# EasyEDA schematic SCH_TRSID_2026-05-15.json
TITLE: Sheet_1; REV: 1.0; Date: 2026-05-11; Sheet: 1/1; Drawn By: chengyanyang0510; Company: Your Company
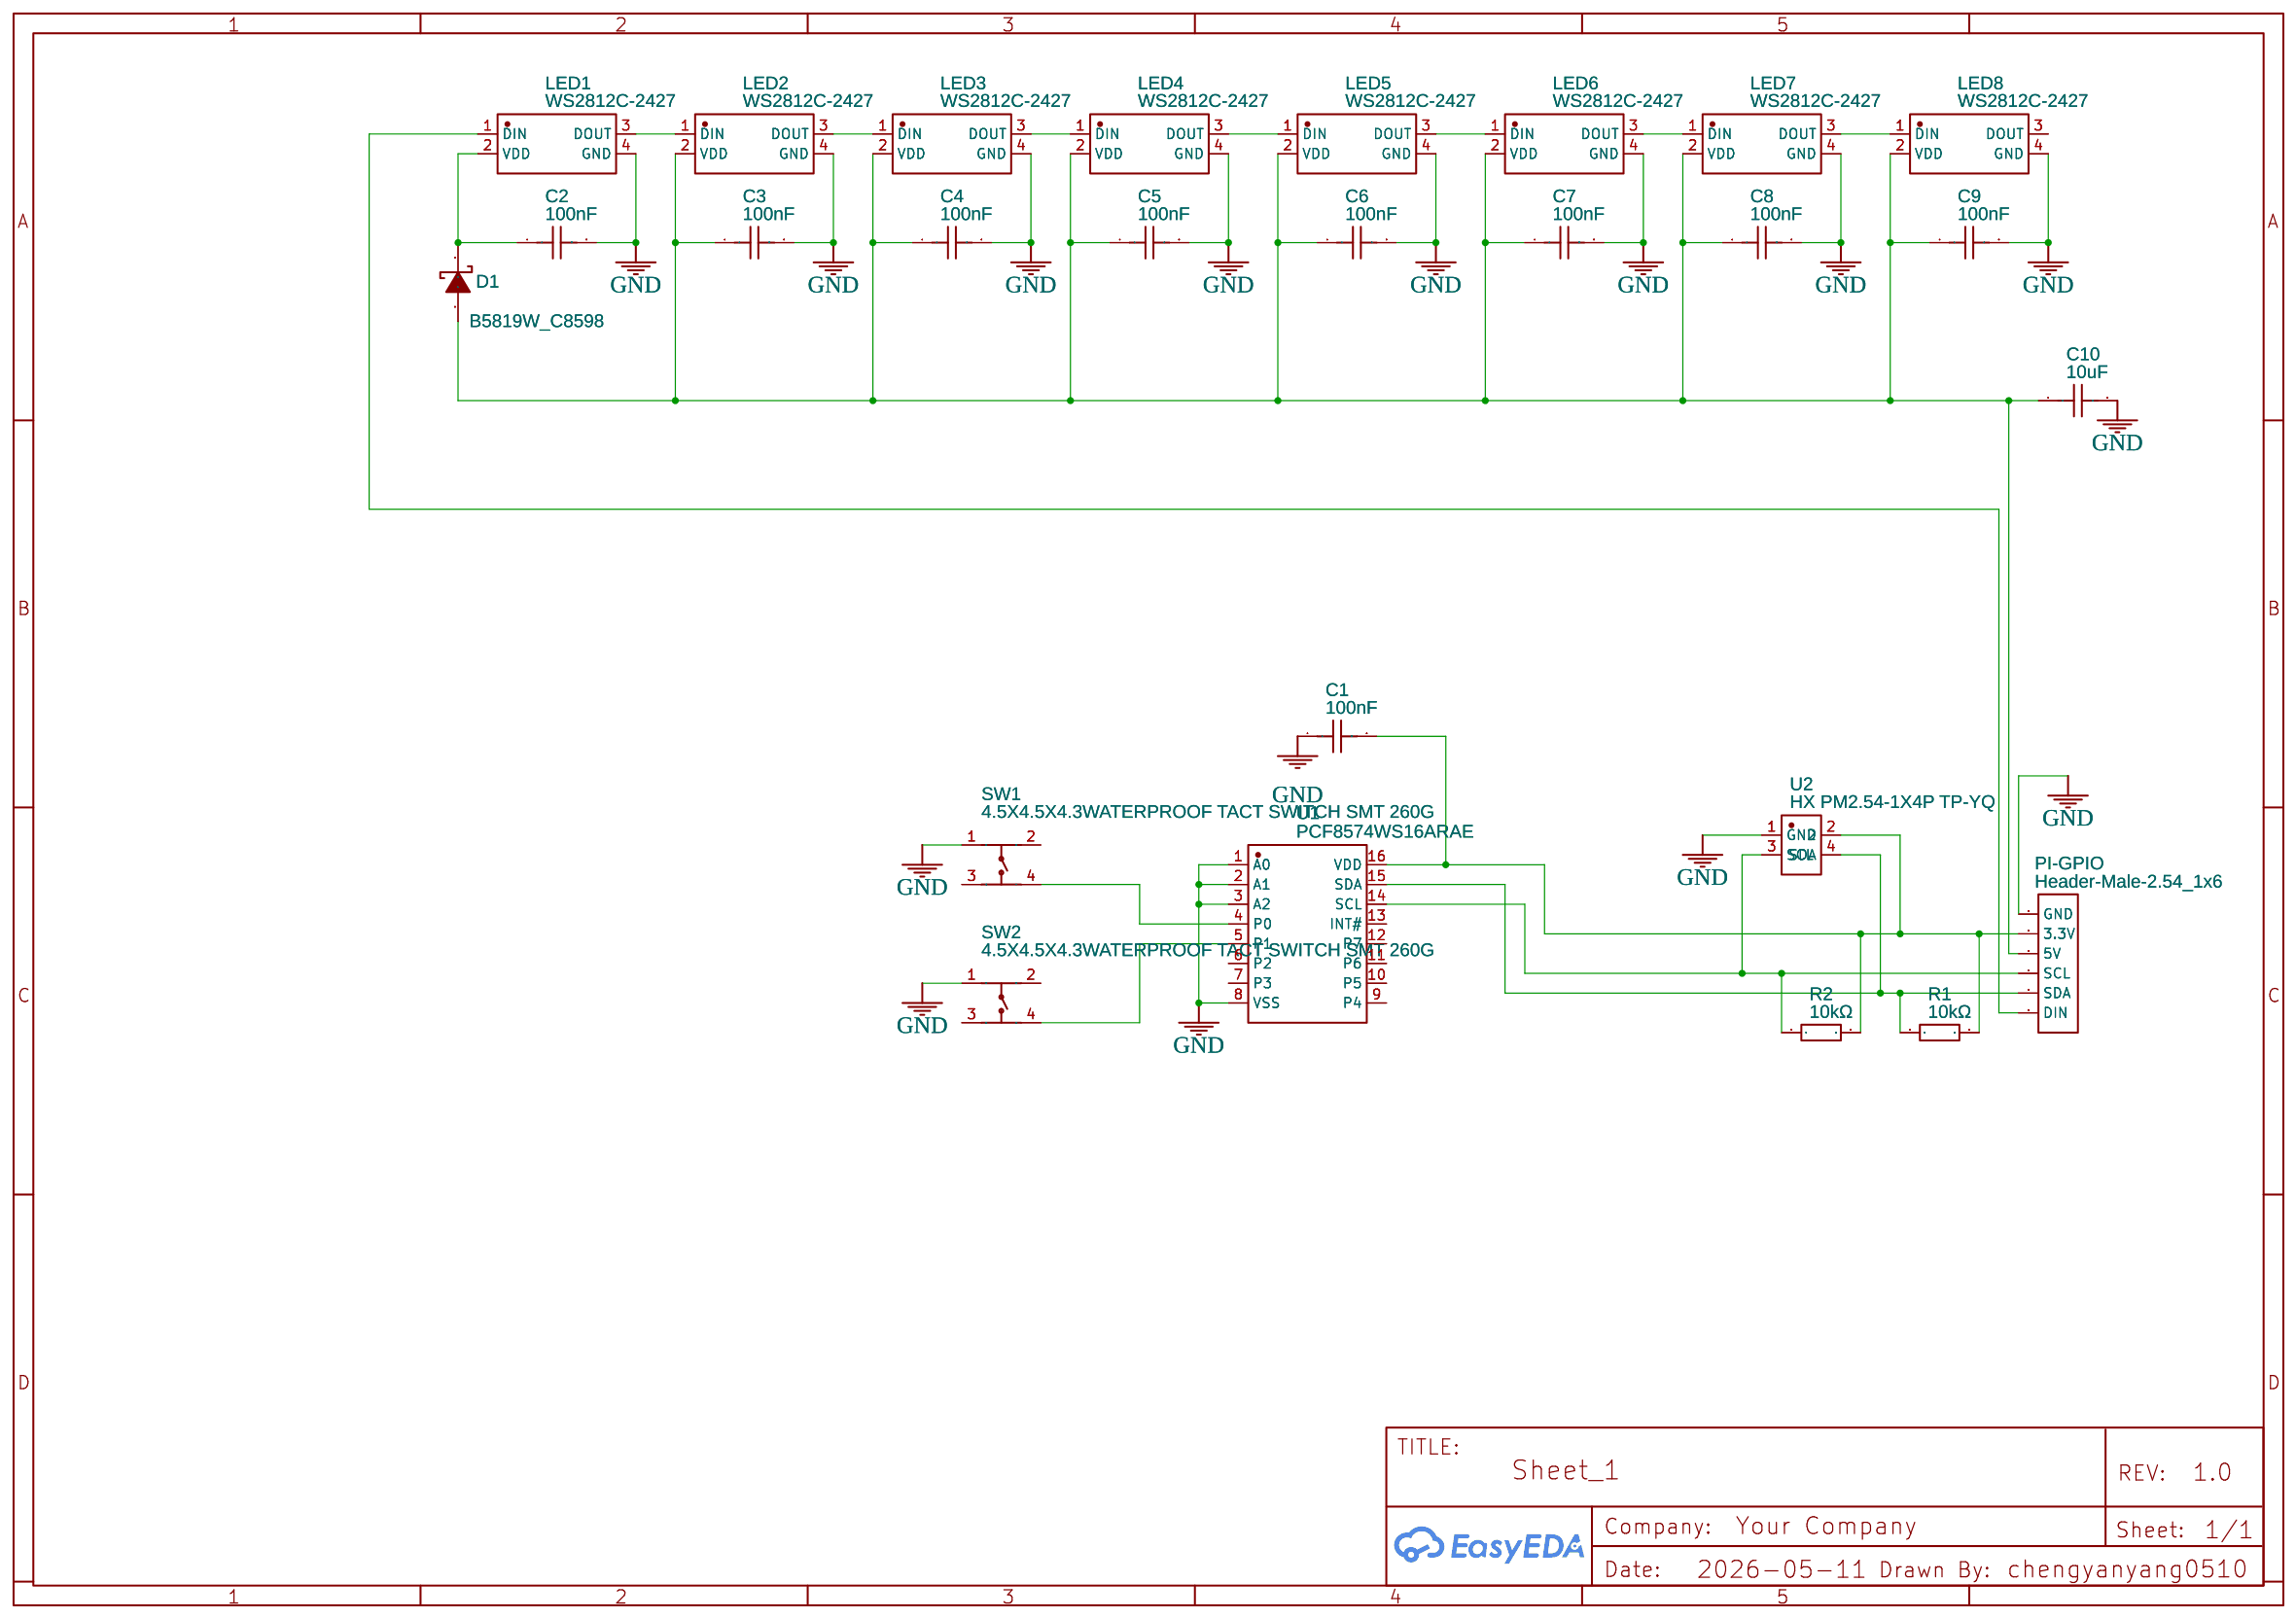
[diagram p0: schematic sheet]

## Parts
C1  100nF  [C0402]
C2  100nF  [C0402]
C3  100nF  [C0402]
C4  100nF  [C0402]
C5  100nF  [C0402]
C6  100nF  [C0402]
C7  100nF  [C0402]
C8  100nF  [C0402]
C9  100nF  [C0402]
C10  10uF  [C0603]
D1  B5819W_C8598  [SOD-123_L2.7-W1.6-LS3.7-RD-1]
LED1  WS2812C-2427  [LED-SMD_4P-L2.7-W2.4-TL_WS2812C-2427]
LED2  WS2812C-2427  [LED-SMD_4P-L2.7-W2.4-TL_WS2812C-2427]
LED3  WS2812C-2427  [LED-SMD_4P-L2.7-W2.4-TL_WS2812C-2427]
LED4  WS2812C-2427  [LED-SMD_4P-L2.7-W2.4-TL_WS2812C-2427]
LED5  WS2812C-2427  [LED-SMD_4P-L2.7-W2.4-TL_WS2812C-2427]
LED6  WS2812C-2427  [LED-SMD_4P-L2.7-W2.4-TL_WS2812C-2427]
LED7  WS2812C-2427  [LED-SMD_4P-L2.7-W2.4-TL_WS2812C-2427]
LED8  WS2812C-2427  [LED-SMD_4P-L2.7-W2.4-TL_WS2812C-2427]
PI-GPIO  Header-Male-2.54_1x6  [HDR-TH_6P-P2.54-V-M-1]
R1  10kΩ  [R1206]
R2  10kΩ  [R1206]
SW1  4.5X4.5X4.3WATERPROOF TACT SWITCH SMT 260G  [SW-SMD_4P-L4.5-W4.5-P3.15-LS7.5-TL]
SW2  4.5X4.5X4.3WATERPROOF TACT SWITCH SMT 260G  [SW-SMD_4P-L4.5-W4.5-P3.15-LS7.5-TL]
U1  PCF8574WS16ARAE  [SOP-16_L10.3-W7.5-P1.27-LS10.3-BL]
U2  HX PM2.54-1X4P TP-YQ  [HDR-SMD_HX-PM2.54-1X4P-TP-YQ]

## Library data of the parts
C1-C9 = CL05B104KO5NNNC: Supplier: LCSC; Manufacturer: SAMSUNG(三星); Supplier Part: C1525; JLCPCB Part Class: Basic Part
C10 = CL10A106KP8NNNC: Supplier: LCSC; Manufacturer: SAMSUNG(三星); Supplier Part: C19702; JLCPCB Part Class: Basic Part
D1 = B5819W_C8598: Supplier: LCSC; Manufacturer: CJ(江苏长电/长晶); Manufacturer Part: B5819W SL; Supplier Part: C8598; JLCPCB Part Class: Basic Part
LED1-LED8 = WS2812C-2427: Supplier: LCSC; Supplier Part: C4154872; Manufacturer: worldsemi; Contributor: lcsc; JLCPCB Part Class: Extended Part
PI-GPIO = Header-Male-2.54_1x6: Supplier: LCSC; Manufacturer: BOOMELE(博穆精密); Manufacturer Part: 2.54-1x6P直针; Supplier Part: C37208; JLCPCB Part Class: Extended Part
R1 R2 = 1206W4F1002T5E: Supplier: LCSC; Manufacturer: UNI-ROYAL(厚声); Supplier Part: C17902; JLCPCB Part Class: Basic Part
SW1 SW2 = 4.5X4.5X4.3WATERPROOF TACT SWITCH SMT 260G: Supplier: LCSC; Supplier Part: C39832244; Manufacturer: CAX(创都); Manufacturer Part: 4.5x4.5x4.3Waterproof Tact Switch SMT 260g; Contributor: lcsc
U1 = PCF8574WS16ARAE: Supplier: LCSC; Supplier Part: C49443602; Manufacturer: GR(国睿); Contributor: lcsc; JLCPCB Part Class: Extended Part
U2 = HX PM2.54-1X4P TP-YQ: Supplier: LCSC; Supplier Part: C42379197; Manufacturer: hanxia(韩下); Manufacturer Part: HX PM2.54-1x4P TP-YQ; JLCPCB Part Class: Extended Part; Contributor: lcsc

## Nets
GND: C1.1 C2.2 C3.2 C4.2 C5.2 C6.2 C7.2 C8.2 C9.2 C10.2 LED1.4(GND) LED2.4(GND) LED3.4(GND) LED4.4(GND) LED5.4(GND) LED6.4(GND) LED7.4(GND) LED8.4(GND) PI-GPIO.1(GND) SW1.1 SW2.1 U1.1(A0) U1.2(A1) U1.3(A2) U1.8(VSS) U2.1(GND)
Net-(C1-2): C1.2 PI-GPIO.2(3.3V) R1.2 R2.2 U1.16(VDD) U2.2
Net-(C2-1): C2.1 D1.1(-) LED1.2(VDD)
Net-(C3-1): C3.1 C4.1 C5.1 C6.1 C7.1 C8.1 C9.1 C10.1 D1.2(+) LED2.2(VDD) LED3.2(VDD) LED4.2(VDD) LED5.2(VDD) LED6.2(VDD) LED7.2(VDD) LED8.2(VDD) PI-GPIO.3(5V)
Net-(LED1-1): LED1.1(DIN) PI-GPIO.6(DIN)
Net-(LED1-3): LED1.3(DOUT) LED2.1(DIN)
Net-(LED2-3): LED2.3(DOUT) LED3.1(DIN)
Net-(LED3-3): LED3.3(DOUT) LED4.1(DIN)
Net-(LED4-3): LED4.3(DOUT) LED5.1(DIN)
Net-(LED5-3): LED5.3(DOUT) LED6.1(DIN)
Net-(LED6-3): LED6.3(DOUT) LED7.1(DIN)
Net-(LED7-3): LED7.3(DOUT) LED8.1(DIN)
Net-(PI-GPIO-4): PI-GPIO.4(SCL) R2.1 U1.14(SCL) U2.3(SCL)
Net-(PI-GPIO-5): PI-GPIO.5(SDA) R1.1 U1.15(SDA) U2.4(SDA)
Net-(SW1-4): SW1.4 U1.4(P0)
Net-(SW2-4): SW2.4 U1.5(P1)

Not connected (* = marked no-connect by the designer): LED8 3(DOUT); SW1 2 3; SW2 2 3; U1 6(P2) 7(P3) 9(P4) 10(P5) 11(P6) 12(P7) 13(INT#)
